# Altium schematic sheet XL6019.schdoc
size 55 x 55 mm
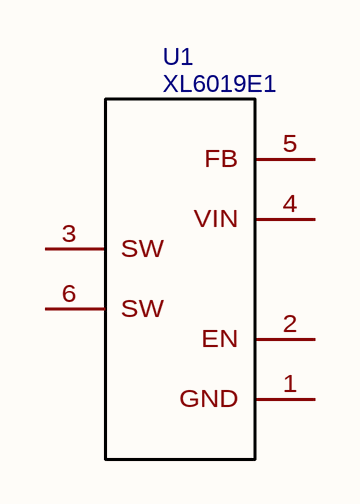
[diagram p0: XL6019.schdoc]

## Parts
U1  XL6019E1  [TO-263-5_L10.2-W9.9-P1.70-LS14.4-TL]

## Nets

Not connected (* = marked no-connect by the designer): U1 1(GND) 2(EN) 3(SW) 4(VIN) 5(FB) 6(SW)

## Library data of the parts
U1 = XL6019E1: BOM_Manufacturer: XLSEMI; BOM_Supplier: LCSC; BOM_Manufacturer Part: XL6019E1; BOM_Supplier Part: C73018; BOM_JLCPCB Part Class: Extended Part; spicePre: U; spiceSymbolName: XL6019E1